# Altium schematic sheet GSB-S06-V00-SPImicrofit.SchDoc
size A4
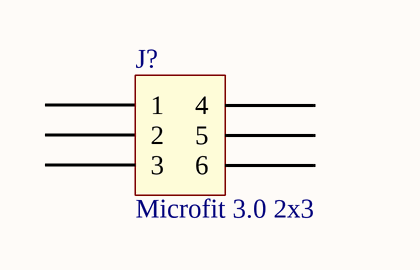
[diagram p0: GSB-S06-V00-SPImicrofit.SchDoc]

## Parts
J?  Microfit 3.0 2x3  [Microfit_2X3_R_TH]

## Nets

Not connected (* = marked no-connect by the designer): J? 1 2 3 4 5 6

## Library data of the parts
J? = Microfit_2x3